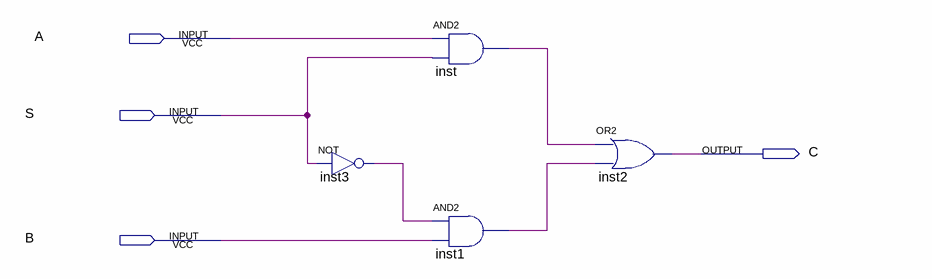
[diagram p0: schematic sheet]
// Quartus schematic MUX1.bdf as structural Verilog: 4 symbols, 4 pins
module MUX1 (
  input  A,
  input  S,
  input  B,
  output C
);

  wire inst1_out, inst3_out, inst_out;

  not inst3 (inst3_out, S);
  and inst (inst_out, A, S);
  and inst1 (inst1_out, inst3_out, B);
  or inst2 (C, inst_out, inst1_out);
endmodule
